# Altium schematic sheet transmitter.SchDoc
size A; SheetNumber: 1; SheetTotal: 1
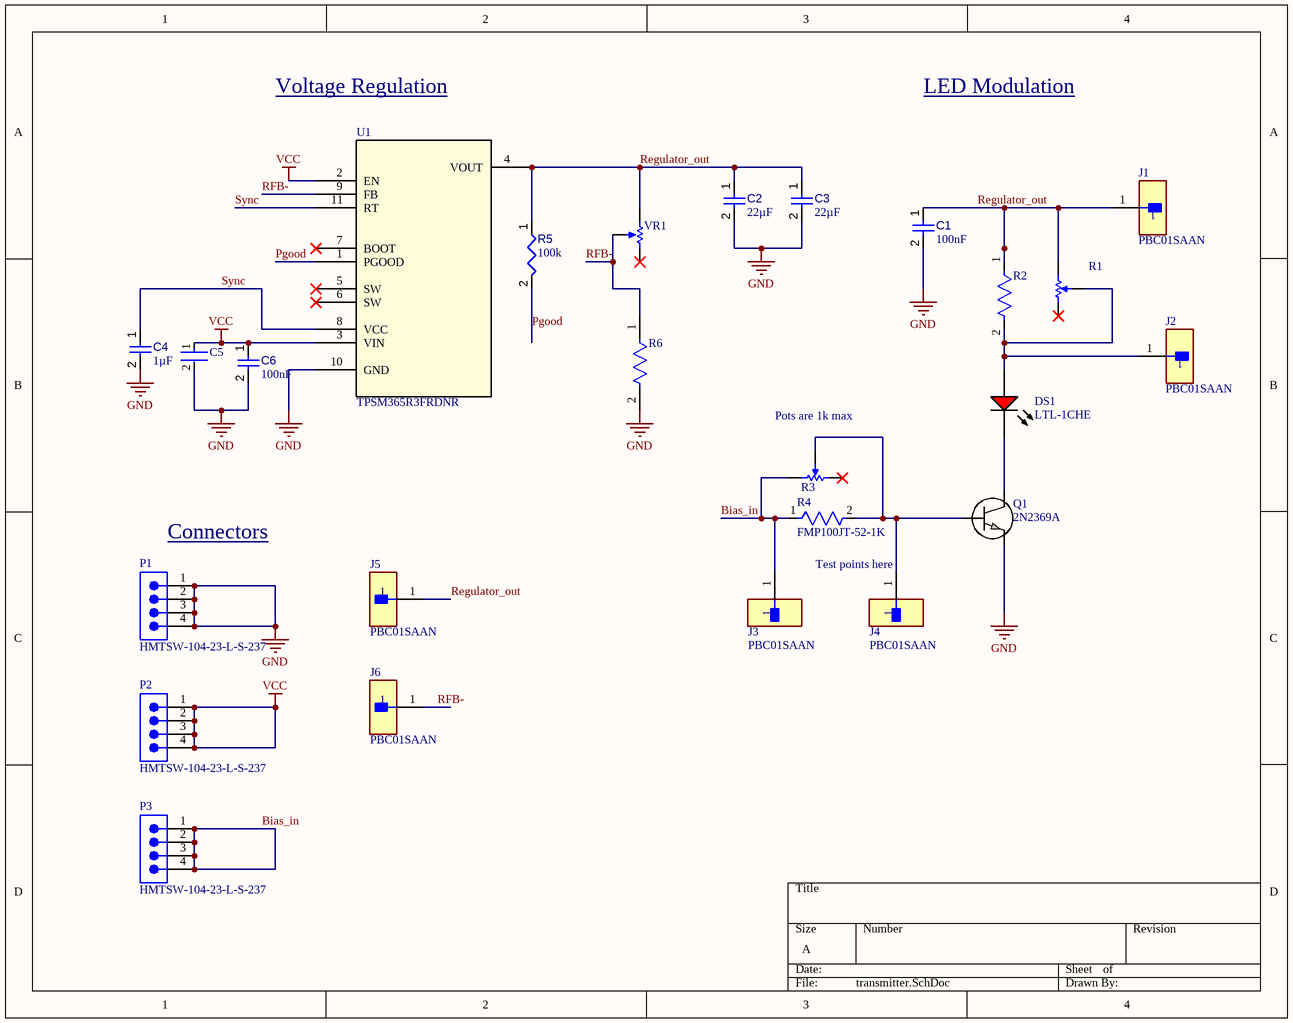
[diagram p0: transmitter.SchDoc]

## Parts
C1  value 100nF  [CAPC0402(1005)60_L]  (hidden comment: Capacitor 100nF +/-20% 50V 0402)
C2  value 22µF  [CAPC0805(2012)145_L]  (hidden comment: Capacitor 22µF +/-40% 16V 0805)
C3  value 22µF  [CAPC0805(2012)145_L]  (hidden comment: Capacitor 22µF +/-40% 16V 0805)
C4  value 1µF  [CAPC0603(1608)100_L]  (hidden comment: Capacitor 1µF +/-0.1% 25V 0603)
C5  GRM21BD72A225ME01K  [FP-GRM21B-0_2-e0_2_0_7-IPC_B]  (value not drawn)
C6  value 100nF  [CAPC2013X95X50LL10T25]  (hidden comment: Capacitor 100 nF +/-10% 50 V 0805)
DS1  LTL-1CHE  [INDPR60-254-520X380X650]
J1  PBC01SAAN  [FP-PBC01SAAN-MFG]
J2  PBC01SAAN  [FP-PBC01SAAN-MFG]
J3  PBC01SAAN  [FP-PBC01SAAN-MFG]
J4  PBC01SAAN  [FP-PBC01SAAN-MFG]
J5  PBC01SAAN  [FP-PBC01SAAN-MFG]
J6  PBC01SAAN  [FP-PBC01SAAN-MFG]
P1  HMTSW-104-23-L-S-237  [SMTC-HMTSW-104-23-X-S-237]
P2  HMTSW-104-23-L-S-237  [SMTC-HMTSW-104-23-X-S-237]
P3  HMTSW-104-23-L-S-237  [SMTC-HMTSW-104-23-X-S-237]
Q1  2N2369A  [TO-18_STM]
R1  3296W-1-102LF  [BOUR-3296W-1-3]  (value not drawn)
R2  MBA02040C2200FC100  [FP-MBA0204-MFG]  (value not drawn)
R3  3296W-1-102LF  [BOUR-3296W-1-3]  (value not drawn)
R4  FMP100JT-52-1K  [FP-FMP100-MFG]
R5  value 100k  [RESC1608X55X25ML10T15]  (hidden comment: Resistor 100k +/-1% 0603 100 mW)
R6  AC2512FK-0710KL  [FP-AC2512-MFG]  (value not drawn)
U1  TPSM365R3FRDNR  [QFN-FCMOD_365R6FRDN_TEX]
VR1  3362P-1-104LF  [BOUR-3362P]  (value not drawn)

## Nets
GND: C1.2 C2.2 C3.2 C4.2 C5.2 C6.2 P1.1 P1.2 P1.3 P1.4 Q1.3(E) R6.2 U1.10(GND)
VCC: C5.1 C6.1 P2.1 P2.2 P2.3 P2.4 U1.2(EN) U1.3(VIN)
Bias_in: J3.1 P3.1 P3.2 P3.3 P3.4 R3.2(B) R4.1
Pgood: R5.2 U1.1(PGOOD)
Regulator_out: C1.1 C2.1 C3.1 J1.1 J5.1 R1.2(B) R2.1 R5.1 U1.4(VOUT) VR1.1(CCW)
RFB-: J6.1 R6.1 U1.9(FB) VR1.2(S)
Sync: C4.1 U1.8(VCC) U1.11(RT)
NetDS1_1: DS1.1(A) J2.1 R1.3(TAP) R2.2
NetDS1_2: DS1.2(K) Q1.1(C)
NetJ4_1: J4.1 Q1.2(B) R3.3(TAP) R4.2

Not connected (* = marked no-connect by the designer): R1 1(A)*; R3 1(A)*; U1 5(SW)* 6(SW)* 7(BOOT)*; VR1 3(CW)*

## Notes on the sheet
- Voltage Regulation
- LED Modulation
- (near R3) Pots are 1k max
- (near P1) Connectors
- Test points here

## Library data of the parts
C1 = CMP-001-00067-3: Chip Capacitor, 100nF +/-20%, 50V, 0402, Thickness 0.6 mm; Tolerance: 10%; Min Operating Temperature: -55°C; Pins: 2; Case/Package: 0402; Max Operating Temperature: 85°C; Voltage Rating: 50V; Mounting Technology: SMT
C2 C3 = CMP-001-00081-4: Chip Capacitor, 22µF +/-40%, 16V, 0805, Thickness 1.45 mm; Tolerance: 5%; Voltage Rating: 16V; Mounting Technology: SMT; Pins: 2; Max Operating Temperature: 85°C; Case/Package: 0805; Min Operating Temperature: -55°C
C4 = CMP-001-00055-4: Chip Capacitor, 1µF +/-0.1%, 25V, 0603, Thickness 1 mm; Tolerance: 20%; Min Operating Temperature: -55°C; Max Operating Temperature: 85°C; Voltage Rating: 25V; Mounting Technology: SMT; Case/Package: 0603; Pins: 2
C5 = CMP-06035-063309-1: CAP CER 2.2UF 100V X7T 0805
C6 = CMP-001-00018-6: Chip Capacitor, 100 nF, +/- 10%, 50 V, 0805 (2012 Metric); Capacitor Type: Ceramic; Voltage Rating: 50V; Pins: 2; Max Operating Temperature: 125°C; Min Operating Temperature: -55°C; Mounting Technology: SM; Case/Package: 0805; RoHS Compliant: True; Tolerance: 10%
DS1 = CMP-007-00018-2: LED Uni-Color Red, 100 mW, 30 mA, -55 to 100 degC, 2-Pin THD, RoHS, Bulk; Manufacturer: Lite-On; Forward Current: 20mA; Nominal Vf: 2V; Viewing Angle: 60degrees; Luminous Intensity: 12.6mcd; Lens Style: Dome; Pins: 2; RoHS Compliant: True; Package Reference: LTL-1CHE; Package Quantity: 1000; Mounting Technology: TH; Min Operating Temperature: -55°C; Colour: Red; Case/Package: Radial; Manufacturer URL: http://www.us.liteon.com/; Datasheet URL: https://datasheet.ciiva.com/15117/getdatasheetpartid-187746-15117985.pdf; Forward Voltage: 2V; Max Operating Temperature: 100°C; Illumination Colour: Red; Package Description: 2-Pin Through Hole Device, Dia 3.8 mm, Pitch 2.54 mm; Packaging: Bulk; Datasheet Version: Dec-03
J1-J6 = CMP-25680-000032-1: CONN HEADER VERT 1POS; Number of Positions: 1; Connector Type: Male Pin; Gender: Male; Pitch: 2.54mm; Contact Material: Bronze; Mount: Through Hole; Length: 2.54mm; Height: 2.54mm; Lead Free: Lead Free; Number of Rows: 1; Contact Plating: Gold; Number of Contacts: 1; Housing Material: Plastic; Termination: Solder; Package Quantity: 1; Packaging: Bulk; Color: Black; Contact Mating Length: 0.23inch; Housing Color: Black; Width: 2.54mm
P1-P3 = CMP-1024-00020-1: Modified .025" SQ Post Header, Through-hole, Vertical, -55 to 125 degC, 2.54 mm Pitch, 4-Pin, Male, RoHS; Manufacturer: Samtec; Pitch: 2.54 mm; ComponentLink3URL: http://www.samtec.com/documents/webfiles/cpdf/HMTSW-XXX-XX-X-X-XXXX-XX-XX-MKT1.pdf; PartNumber: HMTSW-104-23-L-S-237; Temperature Range: -55 to 125 degC; ComponentLink1Description: Manufacturer URL; Orientation: Vertical; ComponentLink3Description: Package Specification; ComponentLink2URL: http://www.samtec.com/documents/webfiles/pdf/HMTSW.PDF; DatasheetVersion: F-214; PackageDescription: Assembly .025 [.64] SQ. Post Hi-Temp Terminal Strip; ComponentLink1URL: http://www.samtec.com; PackageReference: HMTSW-104-23-X-S-237; RoHS: True; Mounting Technology: Through-hole; ComponentLink2Description: Datasheet; PackageVersion: AL, 3/1987
Q1 = CMP-010-000000-1: Description; Manufacturer_Name: STMicroelectronics; Copyright: Copyright (C) 2025 Ultra Librarian. All rights reserved.; Design Item ID: 2N2369A; Manufacturer_Part_Number: 2N2369A; Source: 2N2369A.SchLib
R1 R3 = CMP-009-00037-2: Square Trimpot(R) Trimming Potentiometer, 1000 Ohm, -55 to 125 degC, 3-Pin THD, RoHS, Tube; Manufacturer: Bourns; Power: 500mW; Tolerance: 10%; Voltage Rating: 300V; Resistance: 1k; Datasheet Version: May-16; Min Operating Temperature: -55°C; Max Operating Temperature: 150°C; Composition: Potentiometer; Package Description: 3-Pin Through Hole Device, Body 9.53 x 4.83 mm, Pitch 2.54 mm; Manufacturer URL: http://www.bourns.com/; Package Reference: 3296W-1-3; RoHS Compliant: True; Case/Package: 3296W-1-3; Packaging: Rail/Tube; Mounting Technology: TH; Package Quantity: 50; Datasheet URL: http://www.bourns.com/docs/Product-Datasheets/3296.pdf
R2 = CMP-02408-000005-1: RES 220 OHM 0.4W 1% AXIAL; Manufacturer: Vishay BC Components; Automotive Grade: Grade 1; Value: 220Ω; Voltage Rating: 200V; Temperature Coefficient: 50ppm/°C; Description: 220 Ohms ±1% 0.4W Through Hole Resistor Axial Automotive AEC-Q200 Metal Film; Power Rating: 0.25W; Digikey Description: RES 220 OHM 0.4W 1% AXIAL; Height: 1.6mm; Automotive: Yes; Lead Free: Yes; Mouser Description: Thin Film Resistors - Through Hole .4watt 220ohms 1% 1/8watt body size; Temperature Range Low: -55°C; ComponentLink2Description: Datasheet; Temperature: -55°C to +125°C; Device Class L3: Through-Hole Resistors; Manufacturer Part Number: MBA02040C2200FC100; Ipc Land Pattern Name: RESAD500W65L360D160; Octopart: https://octopart.com/mba02040c2200fc100-vishay-43743094; Series: MBA/SMA 0204; RoHS: TRUE; Tolerance: 1%; Package: MBA0204; Device Class L1: Passive Components; ComponentLink2URL: http://www.vishay.com/docs/28766/mbxsma.pdf; Category: Res; Composition: Metal Film; Device Class L2: Resistors; Temperature Range High: +125°C; Resistance: 220Ω
R4 = CMP-00621-25629781-1: Resistor, 1 kOhm, ± 5%, 1 W, Axial Leaded, Metal Film, High Power Flame Proof; Power Rating: 1W; Resistance: 1kΩ; Temperature Coefficient: 100ppm/°C; Length: 6.3mm; Min Operating Temperature: -55°C; Tolerance: 5%; RoHS: Compliant; Military Standard: Not; Mount: Through Hole; Case/Package: Conformal; Diameter: 2.4mm; Schedule B: 8533210090, 8533210090; Radiation Hardening: No; Lead Free: Lead Free; Composition: Metal Film; Max Operating Temperature: 155°C; Termination: Axial
R5 = CMP-009-00023-5: Chip Resistor, 100 KOhm, +/- 1%, 0.1 W, -55 to 155 degC, 0603 (1608 Metric); Voltage Rating: 50V; Power: 100mW; Max Operating Temperature: 155°C; RoHS Compliant: True; Tolerance: 1%; Pins: 2; Case/Package: 0603; Mounting Technology: SM; Min Operating Temperature: -55°C
R6 = CMP-03412-001312-1: RES SMD 10K OHM 1% 1W 2512; Manufacturer: Yageo; Resistance: 10KΩ; Description: AC2512 10KΩ 1W 1.00%; Automotive Grade: Grade 0; Voltage Rating: 200V; Value: 10KΩ; Tolerance: 0.01; Device Class L1: Passive Components; Temperature Range High: +155°C; Ipc Land Pattern Name: RESC635310X55; Power Rating: 1W; ComponentLink2Description: Datasheet; RoHS: TRUE; Lead Free: Yes; Manufacturer Part Number: AC2512FK-0710KL; Category: Res; Temperature Range Low: -55°C; Octopart: https://octopart.com/ac2512fk-0710kl-yageo-71369732; Digikey Description: RES SMD 10K OHM 1% 1W 2512; Device Class L3: Chip SMD Resistors; Height: 0.65mm; Composition: Thick Film; Series: AC; Temperature: -55°C to +155°C; ComponentLink2URL: http://www.yageo.com/documents/recent/PYu-AC_51_RoHS_L_6.pdf; Automotive: Yes; Footprint Url: http://www.yageo.com/exep/pages/download/literatures/PYu-R_Mount_10.pdf; Package: AC2512; Device Class L2: Resistors
U1 = CMP-007-000000-1: 3-V to 65-V input, 1-V to 13-V output, 0.3-A synchronous buck converter power module 11-QFN-FCMOD -40 to 125; Manufacturer_Name: Texas Instruments; RefDes: RefDes; Source: TPSM365R3FRDNR.SchLib; Copyright: Copyright (C) 2025 Ultra Librarian. All rights reserved.; Manufacturer_Part_Number: TPSM365R3FRDNR; Design Item ID: TPSM365R3FRDNR; Type: DC DC Converters
VR1 = CMP-1747-00003-1: Square Trimpot(R) Trimming Potentiometer, 100 KOhm, 300 V, -55 to 125 degC, 3-Pin THD, RoHS, Tube; Voltage Rating: 250 V; Case\Package: Axial; Tolerance: 1%; Power Rating: 250 mW; Resistance: 1 mohm; RoHSCompliant: true; ComponentLink2URL: http://www.bourns.com/docs/Product-Datasheets/3362.pdf; ComponentLink1Description: Manufacturer URL; DatasheetVersion: May-16; Package Quantity: 200; ComponentLink2Description: Datasheet; Min Operating Temperature: -55 degC; Mount: Through Hole; PackageDescription: 3-Pin Through Hole Device, Body 6.6 x 6.99 mm, Pitch 2.54 mm; Length: 0.248 inch; ComponentLink1URL: http://www.bourns.com/; PackageReference: 3326P; Max Operating Temperature: 155 degC; Packaging: Bulk